# EAGLE schematic Electronics_Design_v1 v27 (EAGLE 9.7.0)
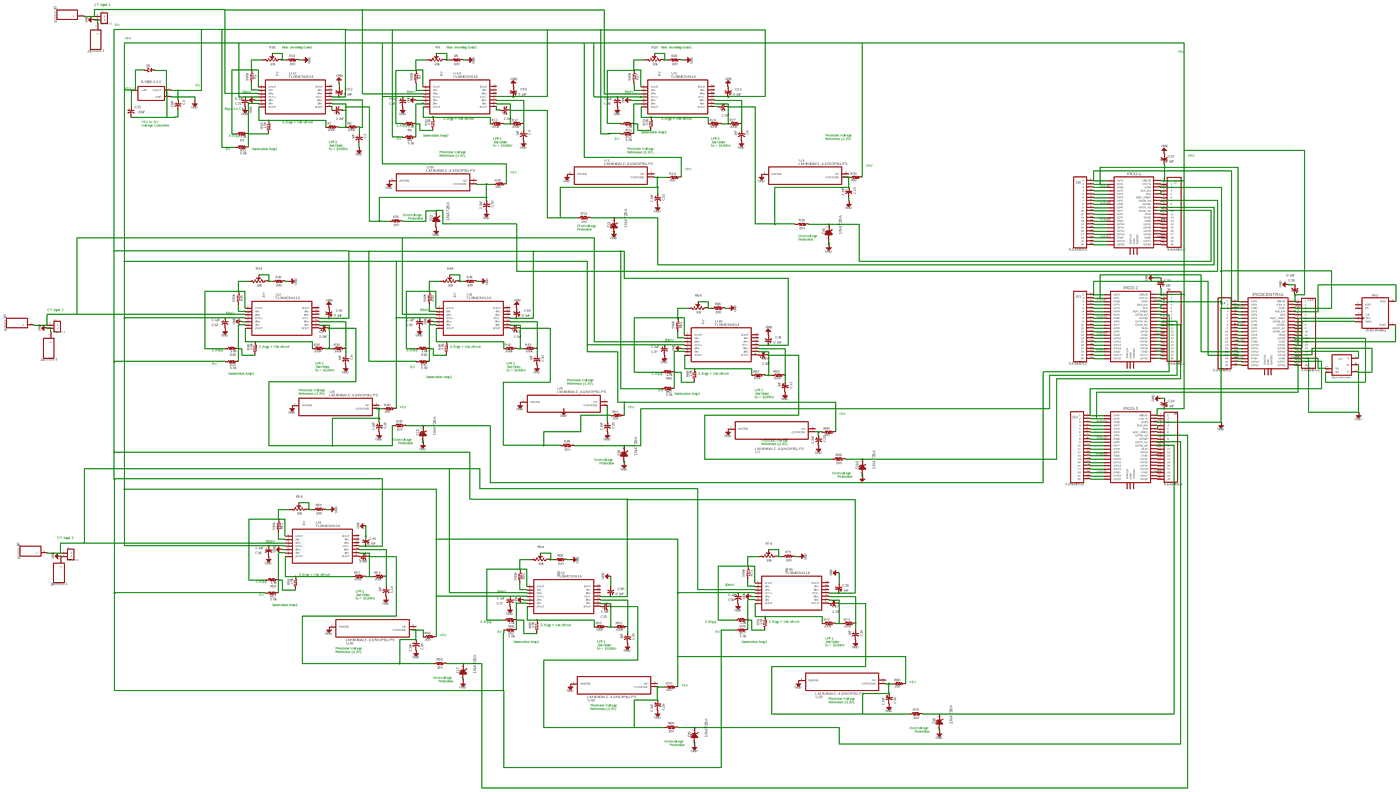
[diagram p0: schematic, sheet 1, overview]
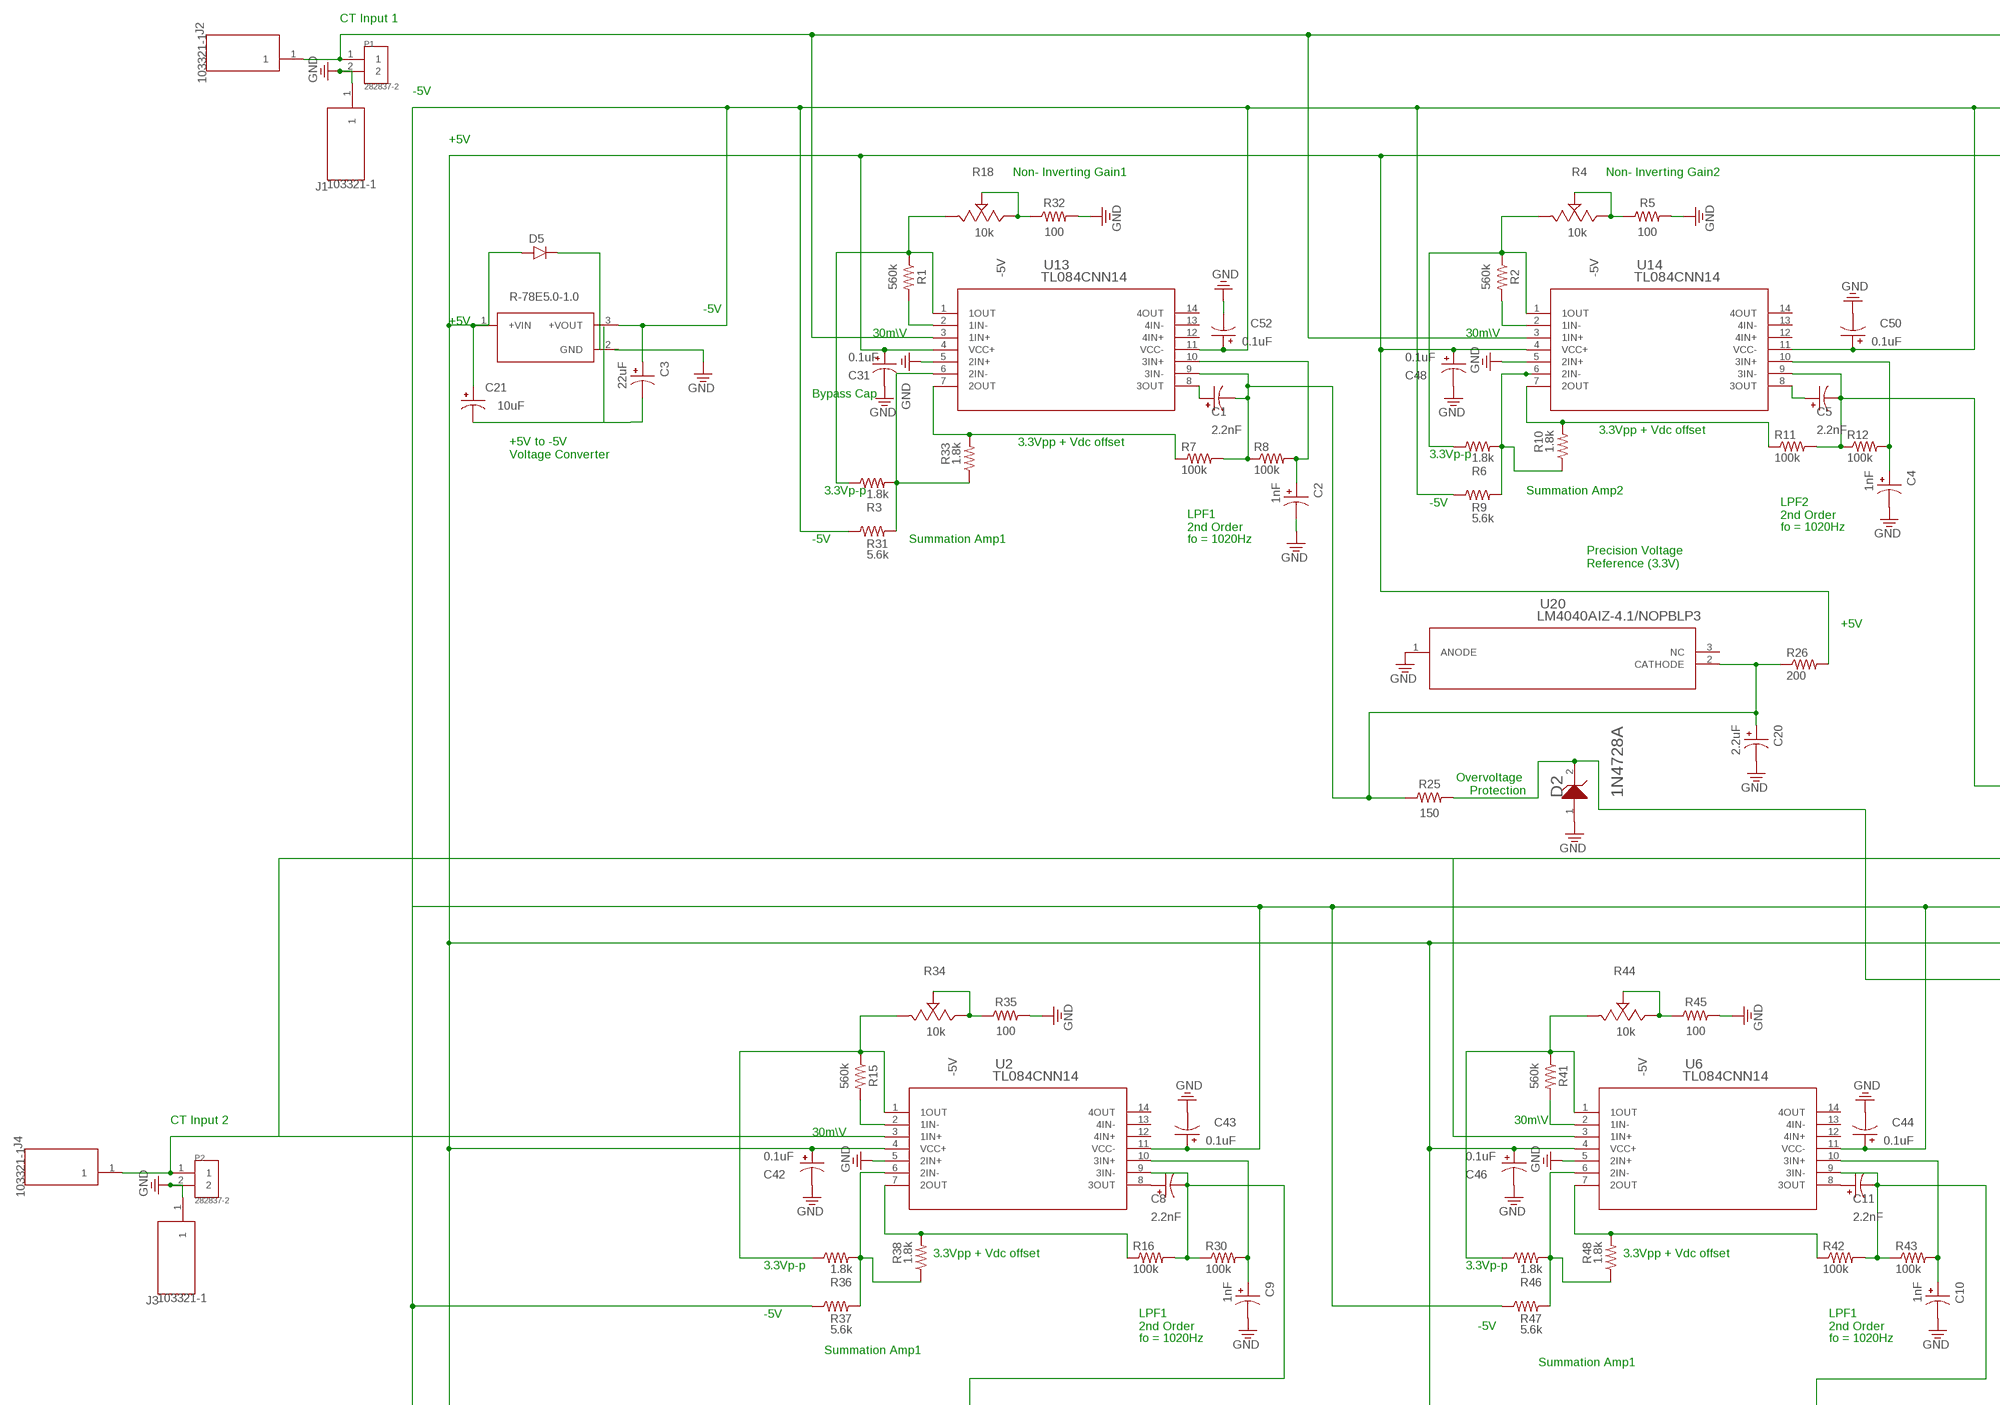
[diagram p1: schematic, sheet 1, part 1 of 6]
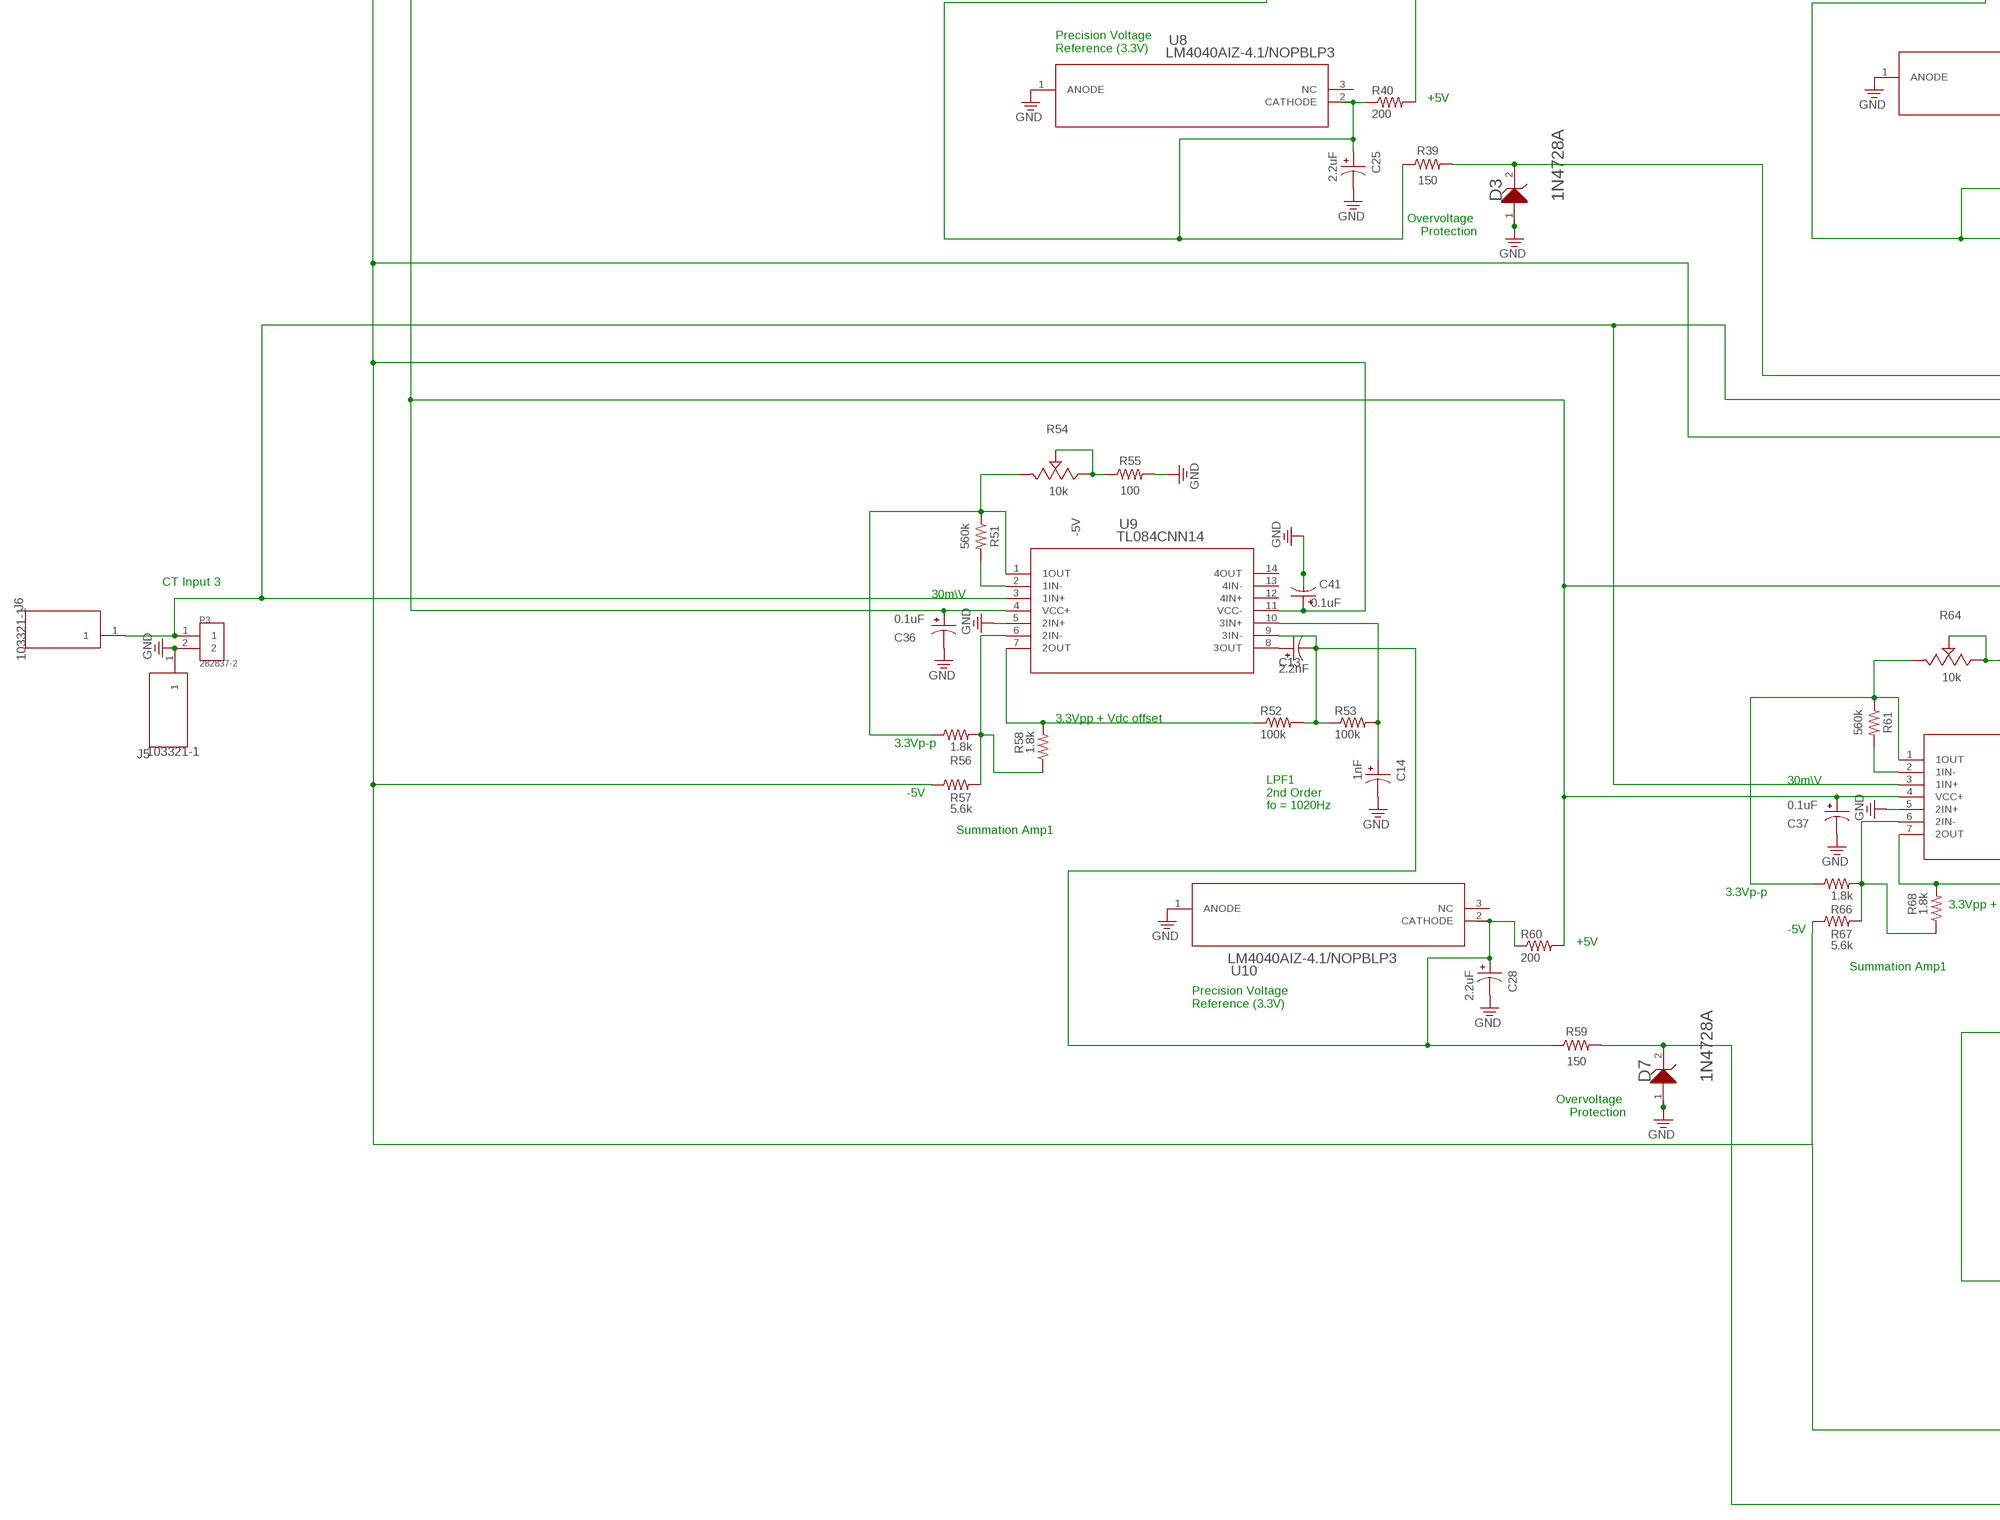
[diagram p2: schematic, sheet 1, part 2 of 6]
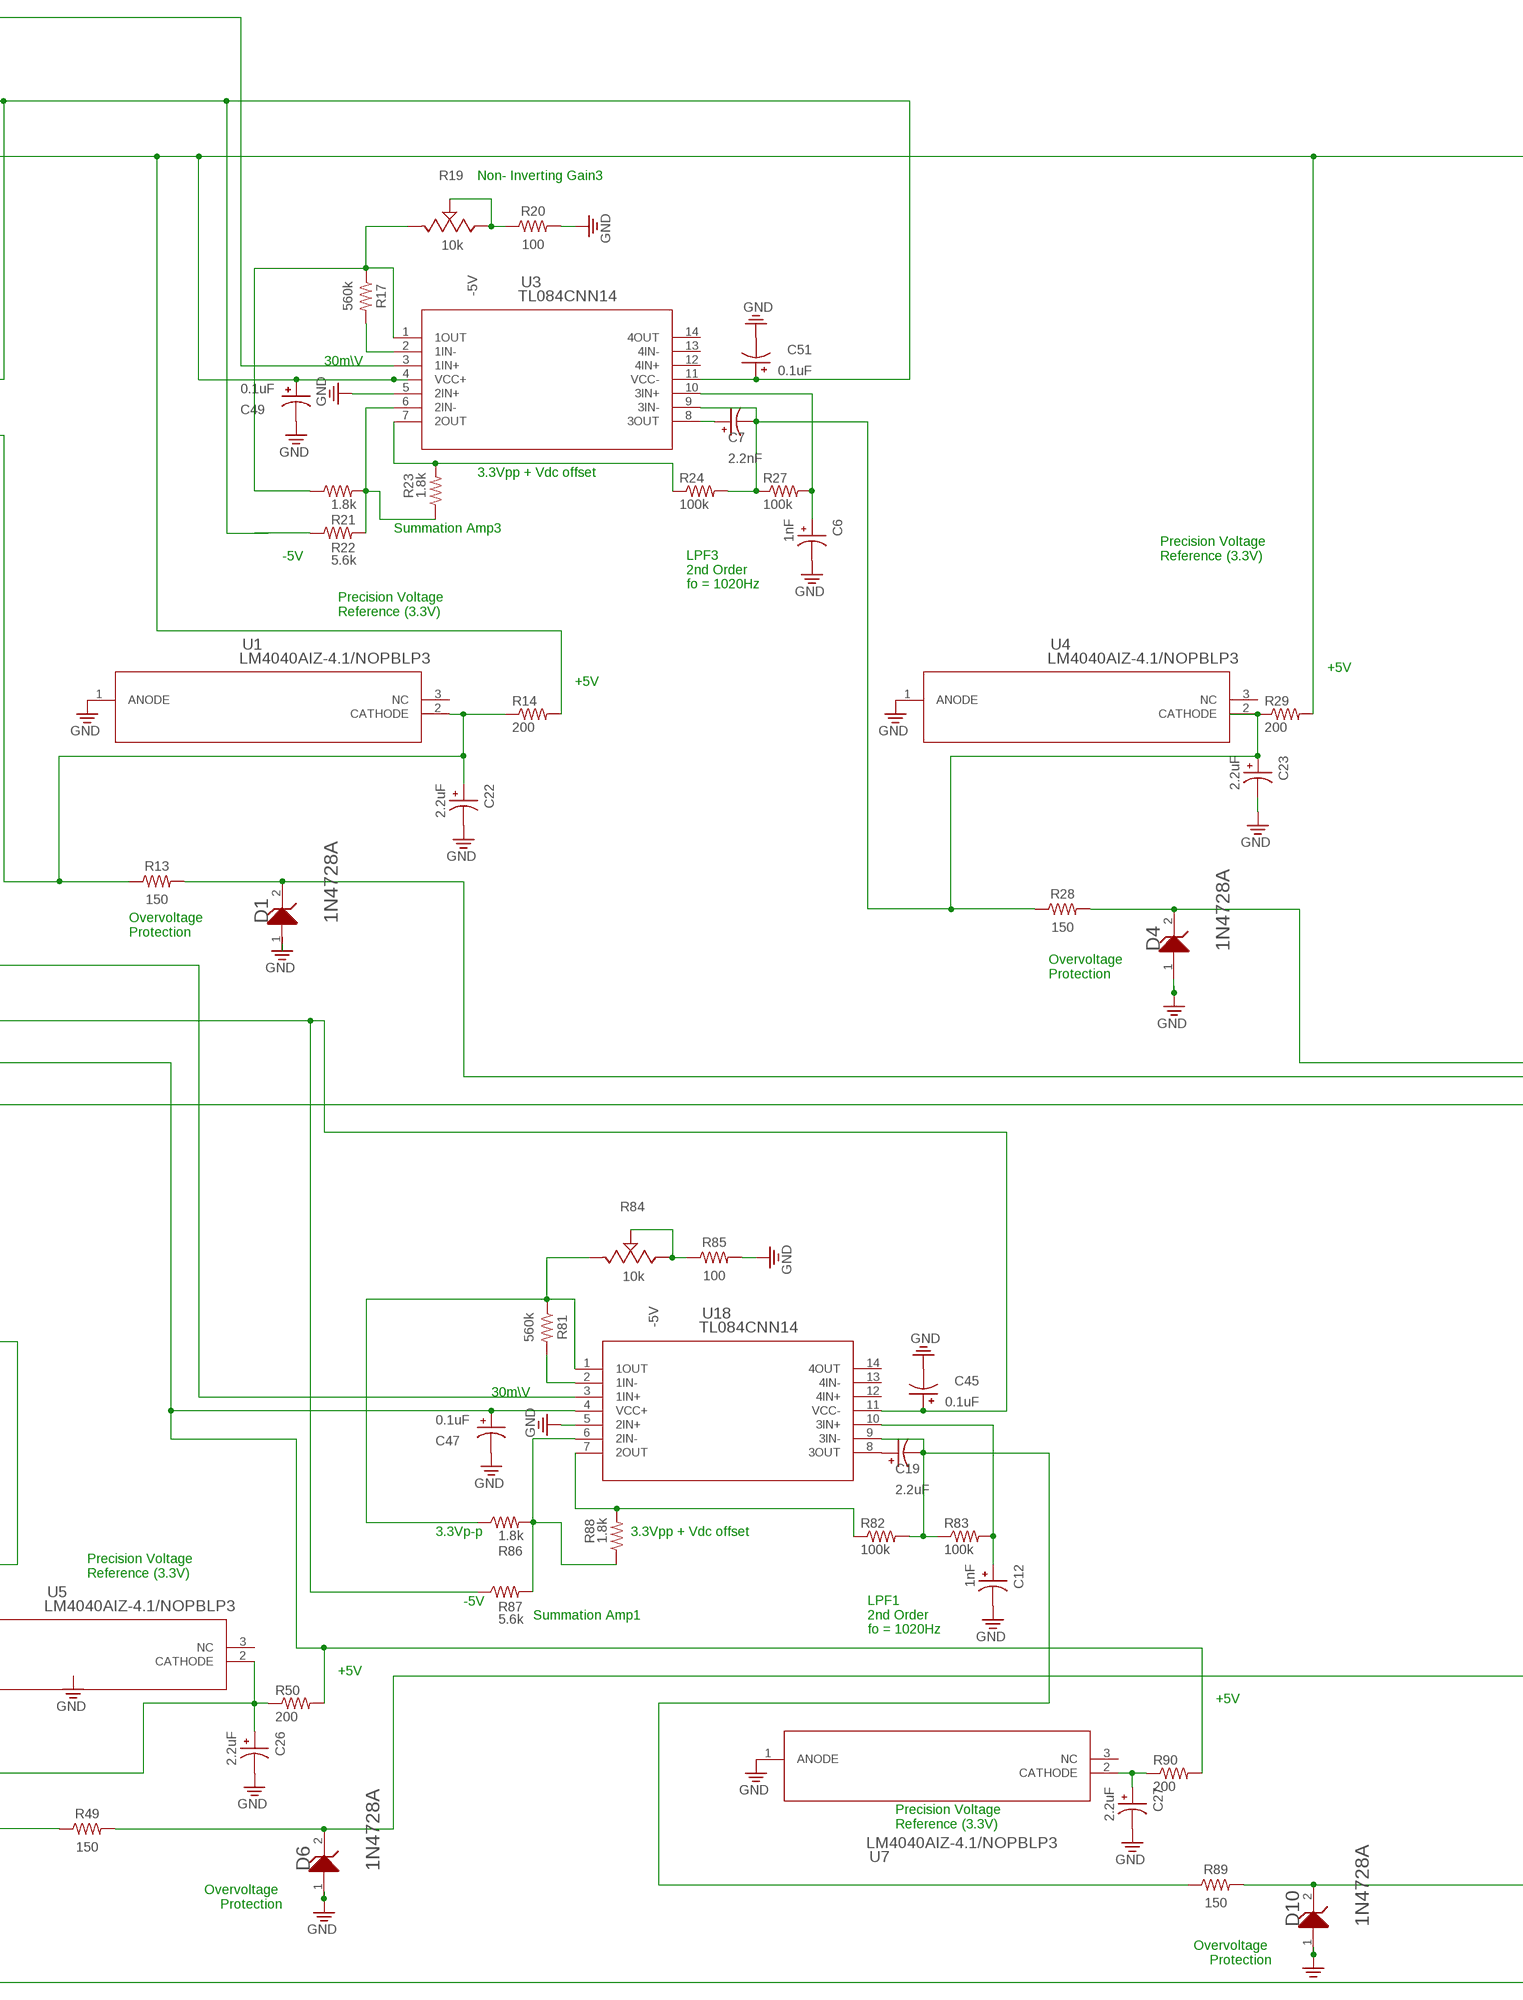
[diagram p3: schematic, sheet 1, part 3 of 6]
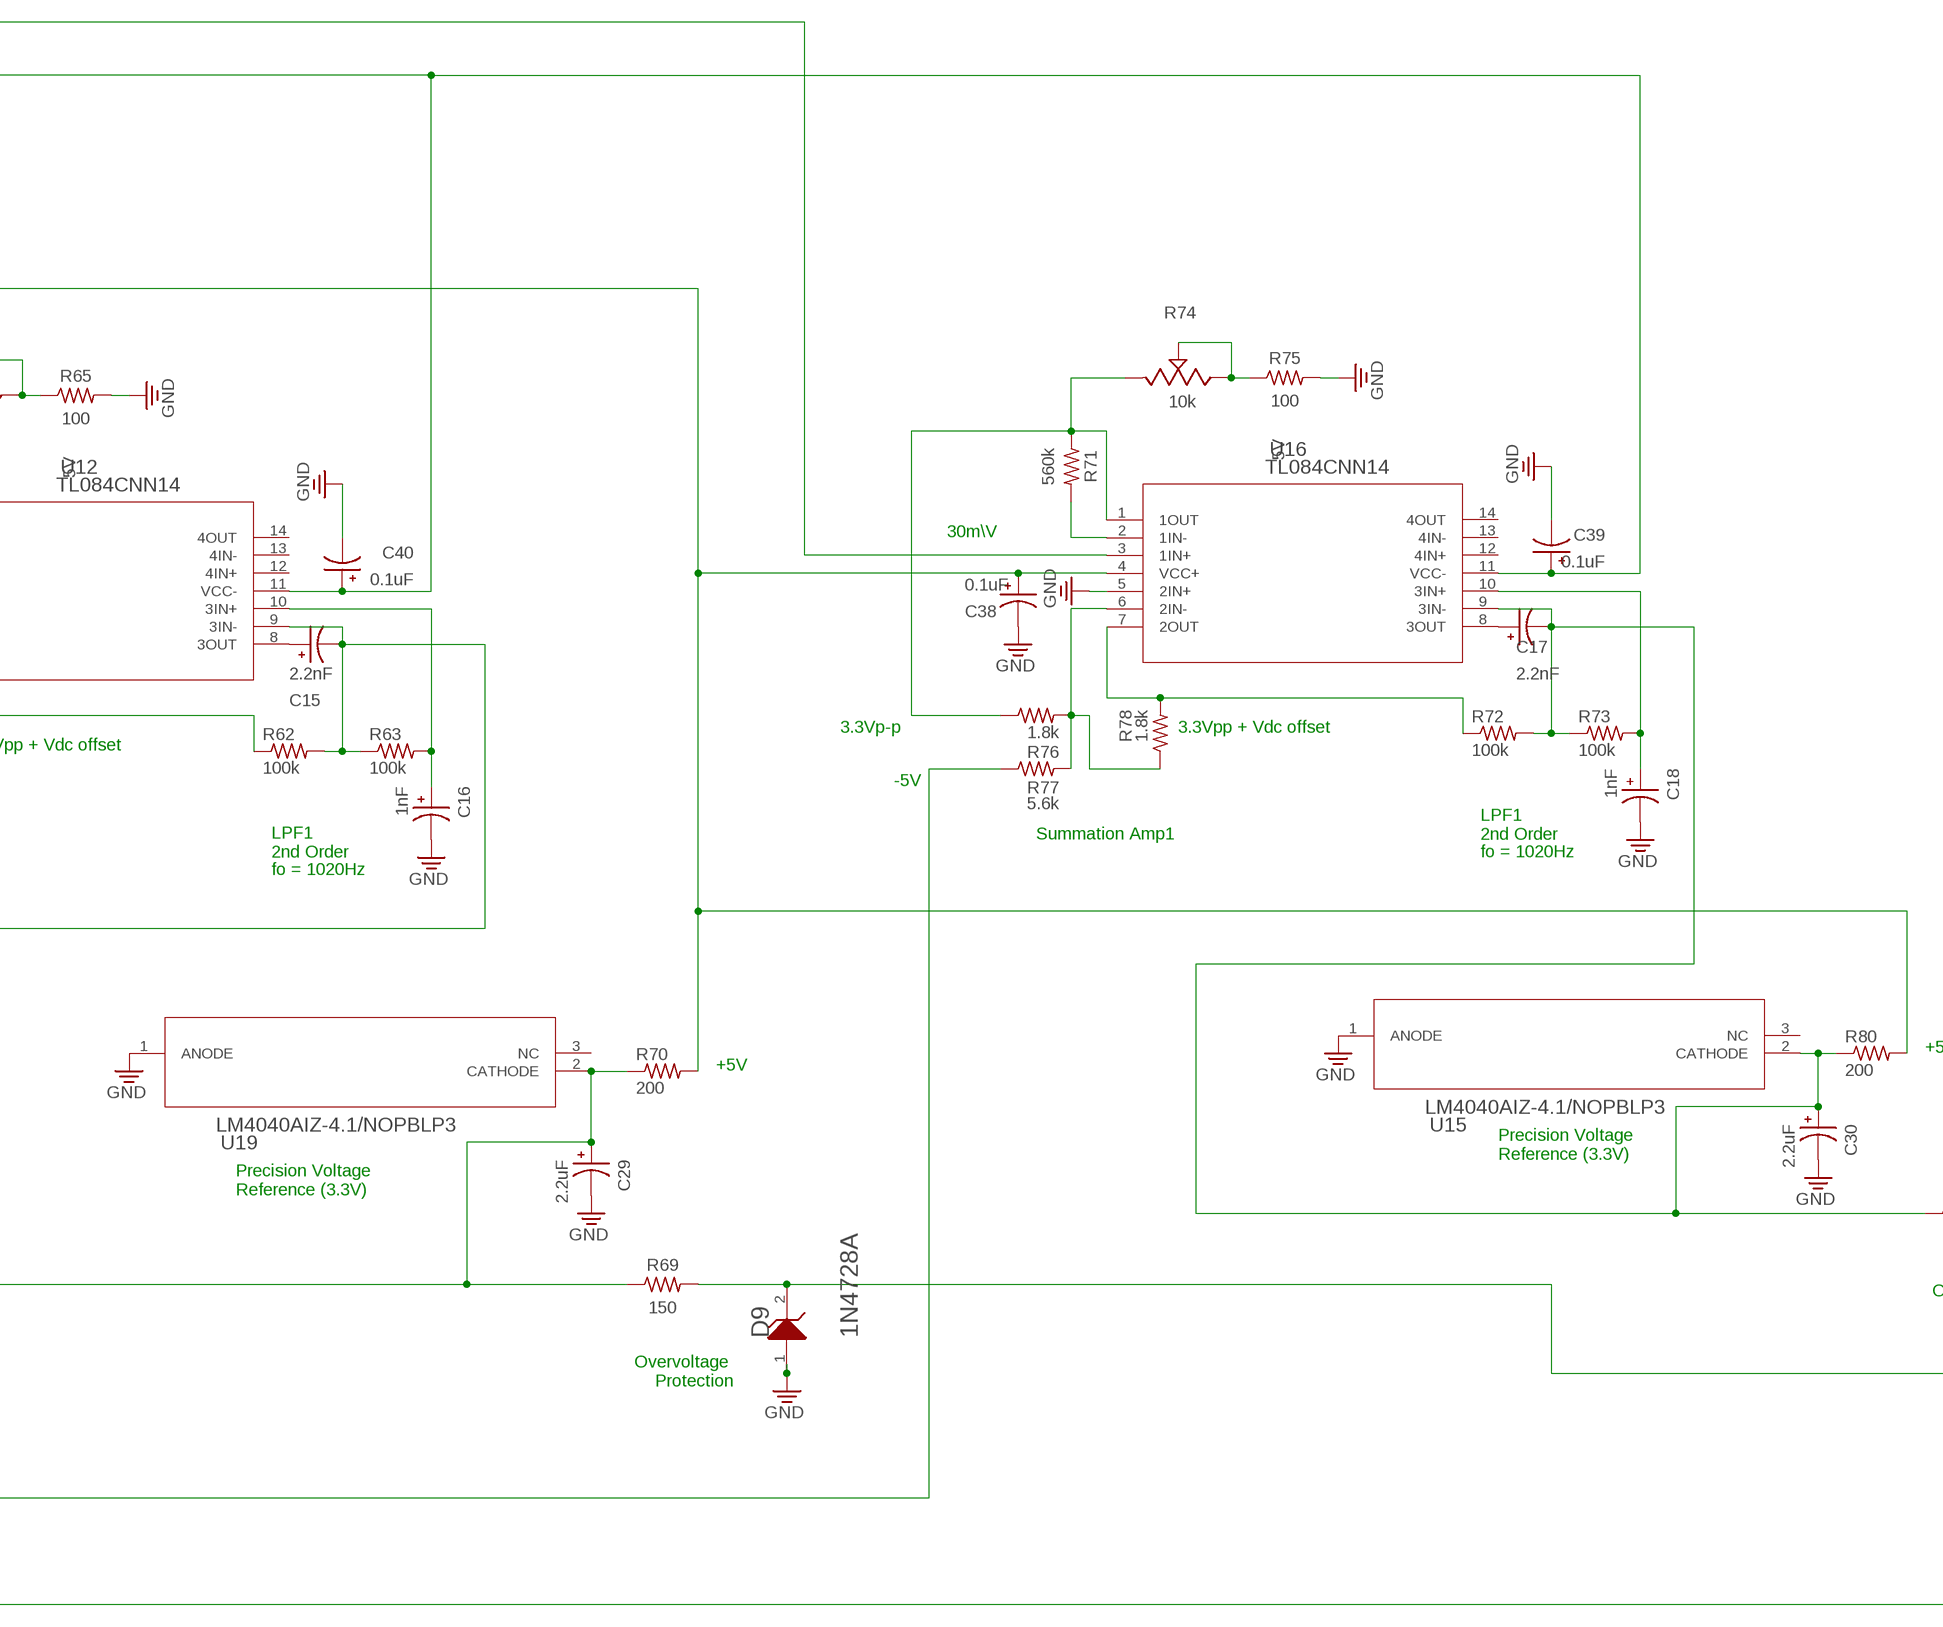
[diagram p4: schematic, sheet 1, part 4 of 6]
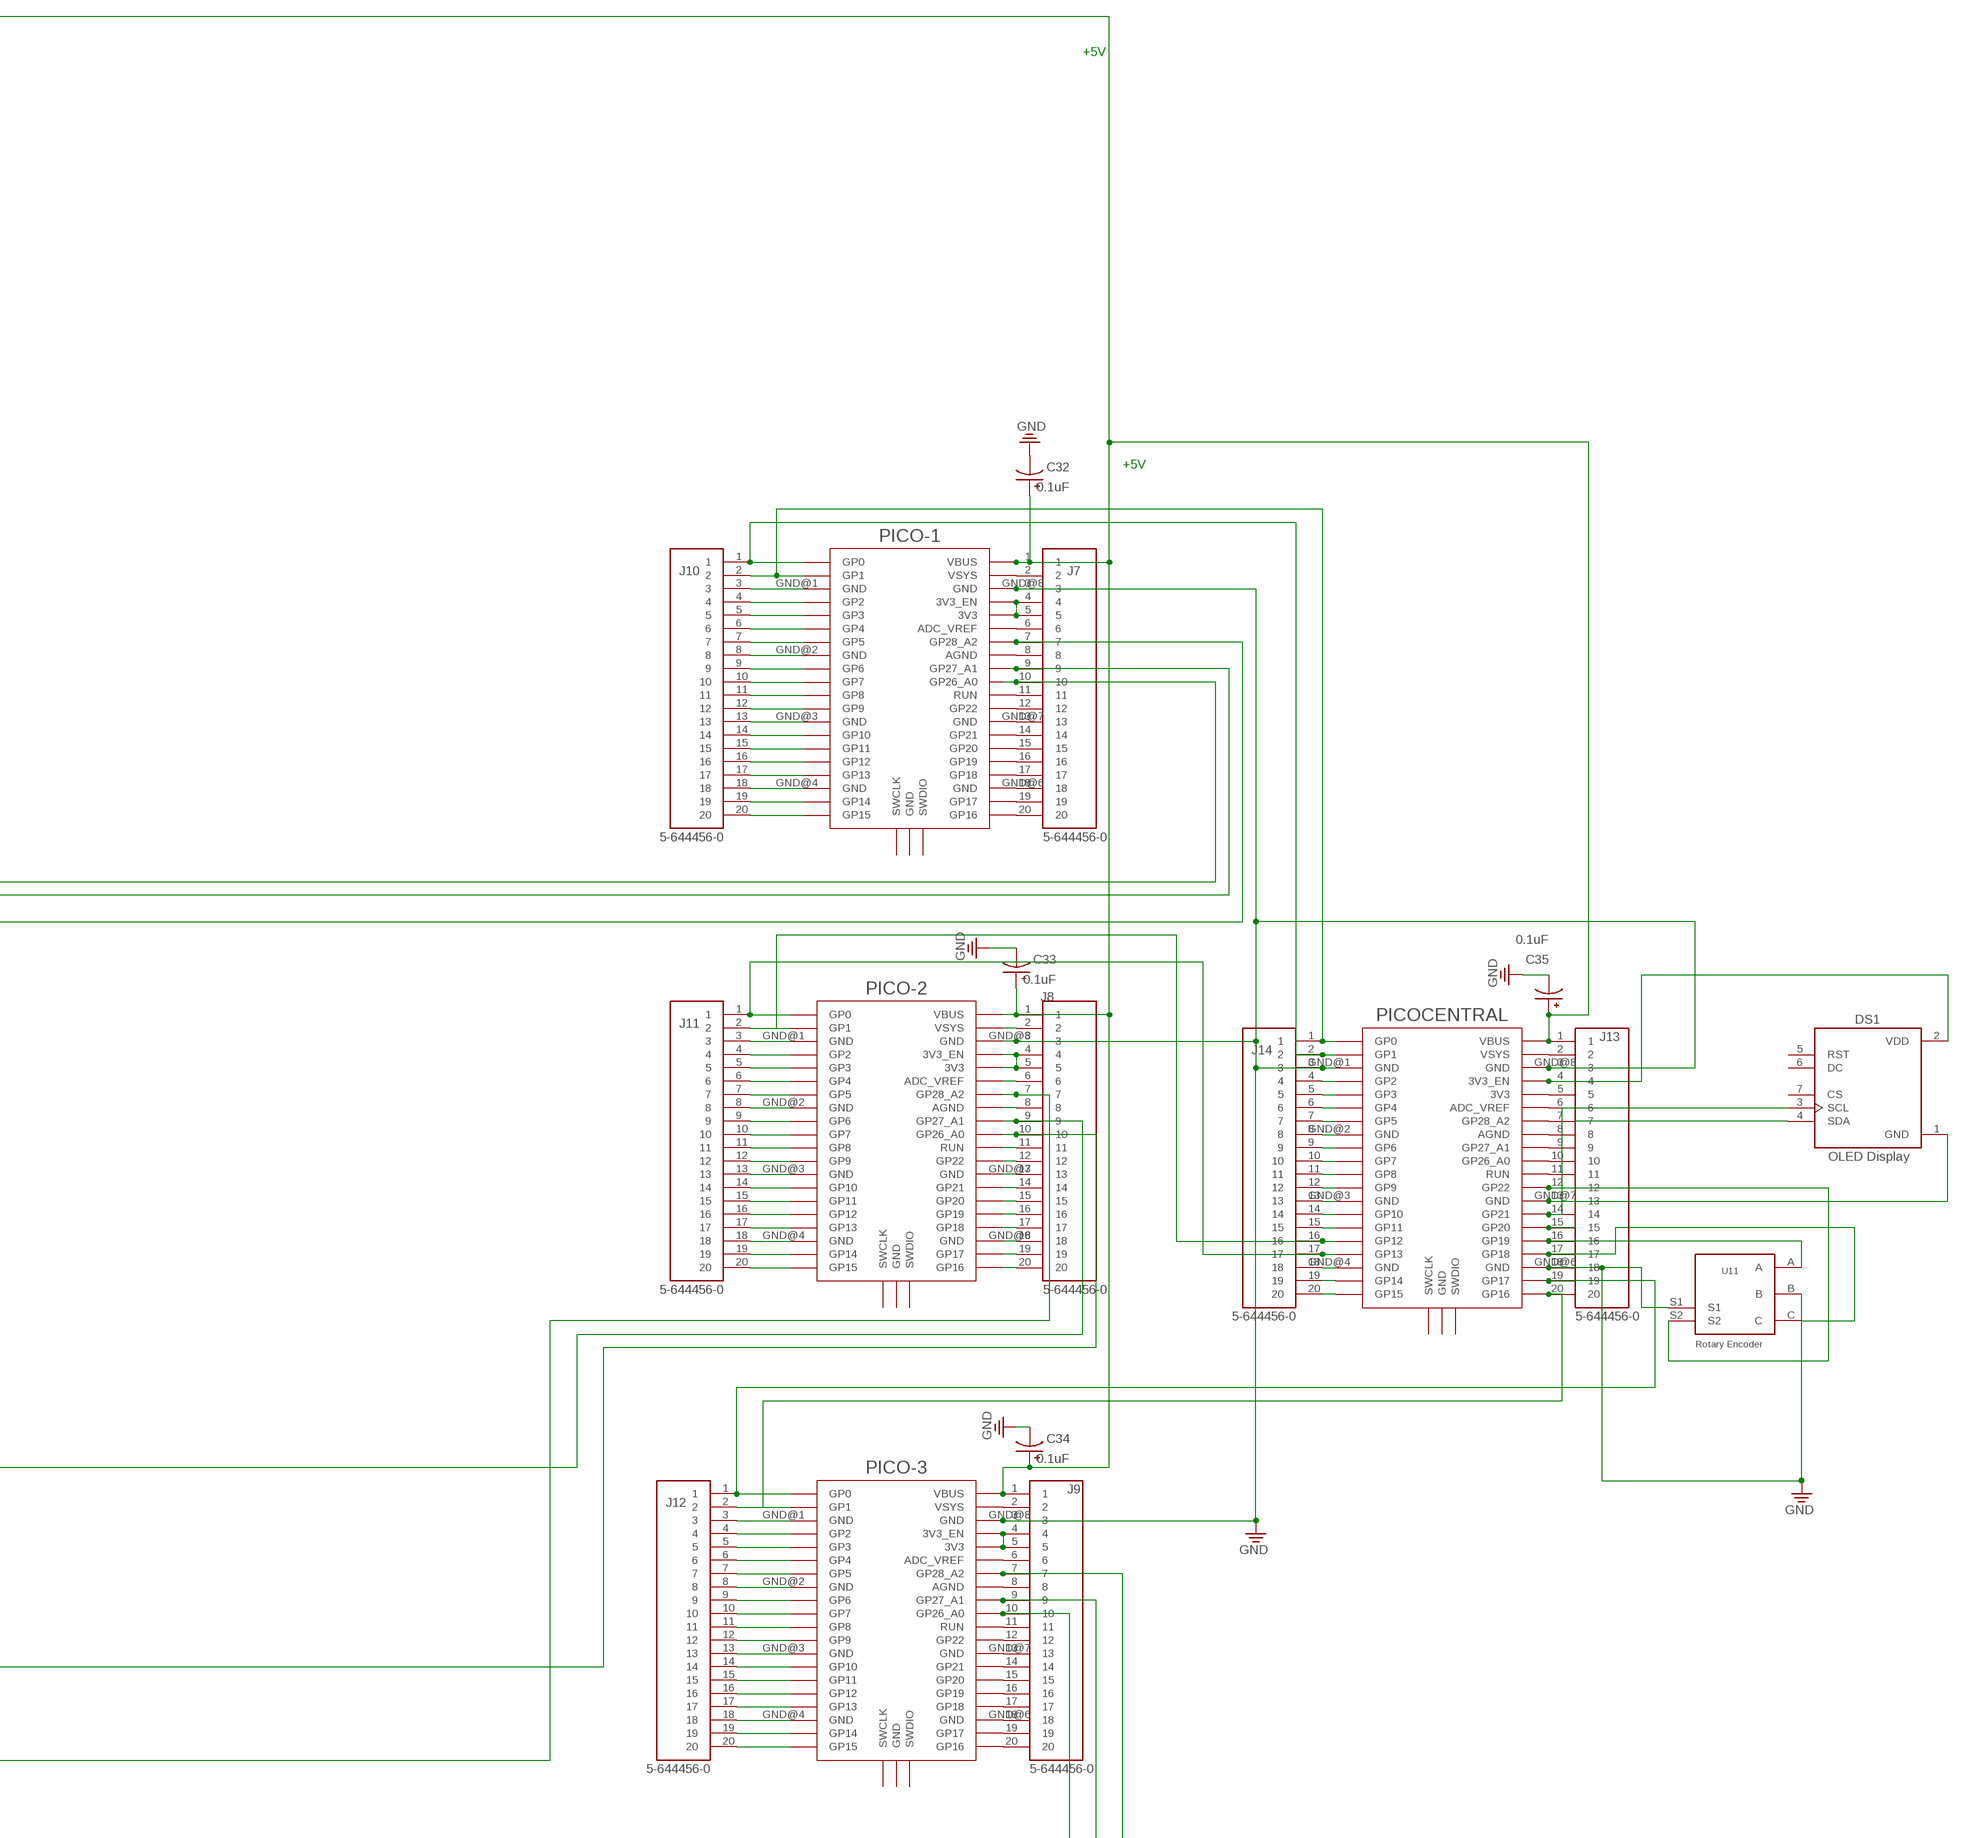
[diagram p5: schematic, sheet 1, part 5 of 6]
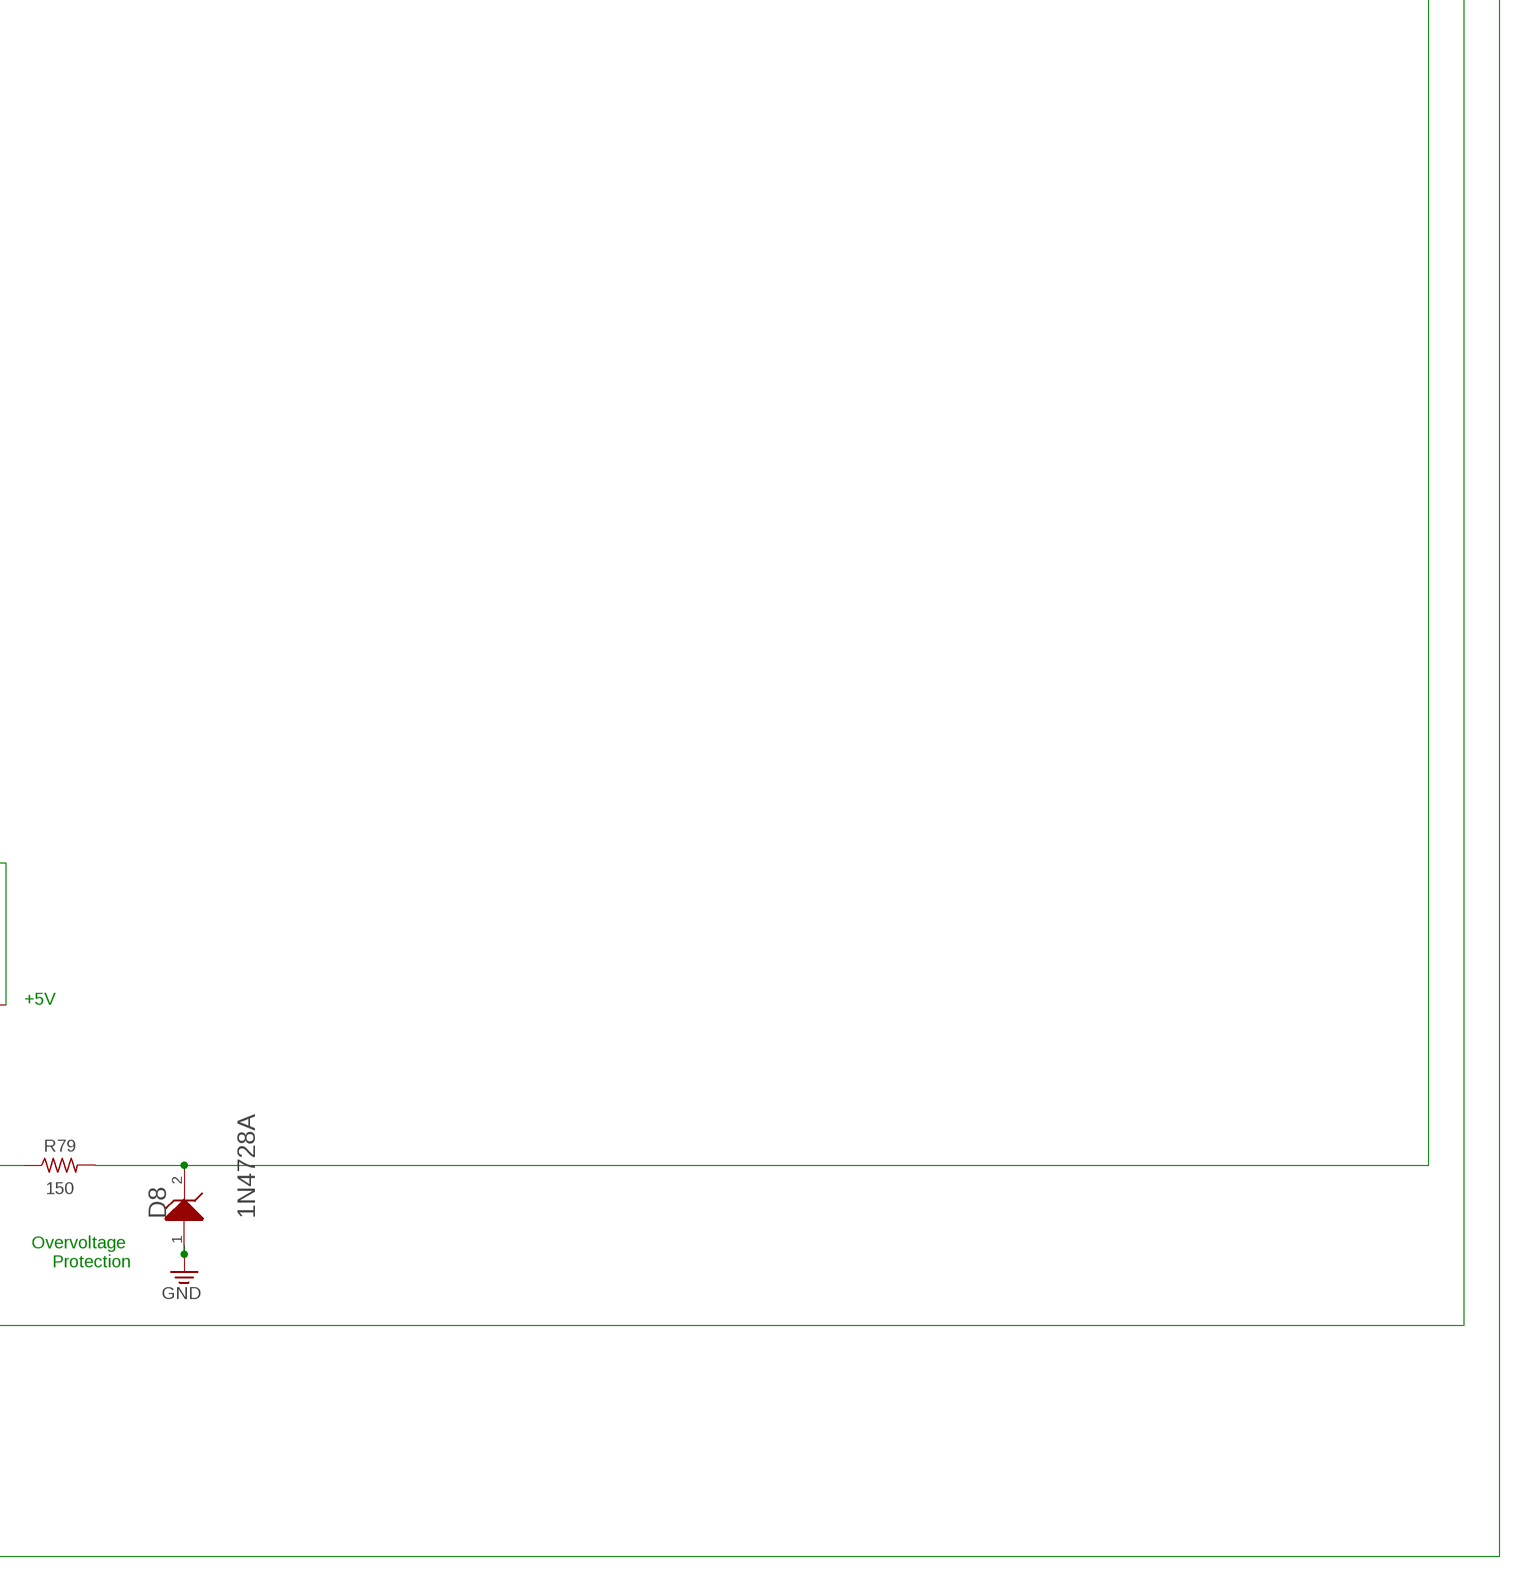
[diagram p6: schematic, sheet 1, part 6 of 6]

## Parts
C1  2.2nF  UPM2A100MED  [CAPPRD250W50D630H1250]
C2  1nF  UPM2A100MED  [CAPPRD250W50D630H1250]
C3  22uF  UPM2A100MED  [CAPPRD250W50D630H1250]
C4  1nF  UPM2A100MED  [CAPPRD250W50D630H1250]
C5  2.2nF  UPM2A100MED  [CAPPRD250W50D630H1250]
C6  1nF  UPM2A100MED  [CAPPRD250W50D630H1250]
C7  2.2nF  UPM2A100MED  [CAPPRD250W50D630H1250]
C8  2.2nF  UPM2A100MED  [CAPPRD250W50D630H1250]
C9  1nF  UPM2A100MED  [CAPPRD250W50D630H1250]
C10  1nF  UPM2A100MED  [CAPPRD250W50D630H1250]
C11  2.2nF  UPM2A100MED  [CAPPRD250W50D630H1250]
C12  1nF  UPM2A100MED  [CAPPRD250W50D630H1250]
C13  2.2nF  UPM2A100MED  [CAPPRD250W50D630H1250]
C14  1nF  UPM2A100MED  [CAPPRD250W50D630H1250]
C15  2.2nF  UPM2A100MED  [CAPPRD250W50D630H1250]
C16  1nF  UPM2A100MED  [CAPPRD250W50D630H1250]
C17  2.2nF  UPM2A100MED  [CAPPRD250W50D630H1250]
C18  1nF  UPM2A100MED  [CAPPRD250W50D630H1250]
C19  2.2uF  UPM2A100MED  [CAPPRD250W50D630H1250]
C20  2.2uF  UPM2A100MED  [CAPPRD250W50D630H1250]
C21  10uF  UPM2A100MED  [CAPPRD250W50D630H1250]
C22  2.2uF  UPM2A100MED  [CAPPRD250W50D630H1250]
C23  2.2uF  UPM2A100MED  [CAPPRD250W50D630H1250]
C25  2.2uF  UPM2A100MED  [CAPPRD250W50D630H1250]
C26  2.2uF  UPM2A100MED  [CAPPRD250W50D630H1250]
C27  2.2uF  UPM2A100MED  [CAPPRD250W50D630H1250]
C28  2.2uF  UPM2A100MED  [CAPPRD250W50D630H1250]
C29  2.2uF  UPM2A100MED  [CAPPRD250W50D630H1250]
C30  2.2uF  UPM2A100MED  [CAPPRD250W50D630H1250]
C31  0.1uF  UPM2A100MED  [CAPPRD250W50D630H1250]
C32  0.1uF  UPM2A100MED  [CAPPRD250W50D630H1250]
C33  0.1uF  UPM2A100MED  [CAPPRD250W50D630H1250]
C34  0.1uF  UPM2A100MED  [CAPPRD250W50D630H1250]
C35  0.1uF  UPM2A100MED  [CAPPRD250W50D630H1250]
C36  0.1uF  UPM2A100MED  [CAPPRD250W50D630H1250]
C37  0.1uF  UPM2A100MED  [CAPPRD250W50D630H1250]
C38  0.1uF  UPM2A100MED  [CAPPRD250W50D630H1250]
C39  0.1uF  UPM2A100MED  [CAPPRD250W50D630H1250]
C40  0.1uF  UPM2A100MED  [CAPPRD250W50D630H1250]
C41  0.1uF  UPM2A100MED  [CAPPRD250W50D630H1250]
C42  0.1uF  UPM2A100MED  [CAPPRD250W50D630H1250]
C43  0.1uF  UPM2A100MED  [CAPPRD250W50D630H1250]
C44  0.1uF  UPM2A100MED  [CAPPRD250W50D630H1250]
C45  0.1uF  UPM2A100MED  [CAPPRD250W50D630H1250]
C46  0.1uF  UPM2A100MED  [CAPPRD250W50D630H1250]
C47  0.1uF  UPM2A100MED  [CAPPRD250W50D630H1250]
C48  0.1uF  UPM2A100MED  [CAPPRD250W50D630H1250]
C49  0.1uF  UPM2A100MED  [CAPPRD250W50D630H1250]
C50  0.1uF  UPM2A100MED  [CAPPRD250W50D630H1250]
C51  0.1uF  UPM2A100MED  [CAPPRD250W50D630H1250]
C52  0.1uF  UPM2A100MED  [CAPPRD250W50D630H1250]
D1  FAIRCHILD_SEMICONDUCTOR_1N4728AFAIRCHILD_SEMICONDUCTOR_1N4728A_0_0  [FAIRCHILD_SEMICONDUCTOR_1N4728A_0]
D2  FAIRCHILD_SEMICONDUCTOR_1N4728AFAIRCHILD_SEMICONDUCTOR_1N4728A_0_0  [FAIRCHILD_SEMICONDUCTOR_1N4728A_0]
D3  FAIRCHILD_SEMICONDUCTOR_1N4728AFAIRCHILD_SEMICONDUCTOR_1N4728A_0_0  [FAIRCHILD_SEMICONDUCTOR_1N4728A_0]
D4  FAIRCHILD_SEMICONDUCTOR_1N4728AFAIRCHILD_SEMICONDUCTOR_1N4728A_0_0  [FAIRCHILD_SEMICONDUCTOR_1N4728A_0]
D5  1N914.4  [DO35-4]
D6  FAIRCHILD_SEMICONDUCTOR_1N4728AFAIRCHILD_SEMICONDUCTOR_1N4728A_0_0  [FAIRCHILD_SEMICONDUCTOR_1N4728A_0]
D7  FAIRCHILD_SEMICONDUCTOR_1N4728AFAIRCHILD_SEMICONDUCTOR_1N4728A_0_0  [FAIRCHILD_SEMICONDUCTOR_1N4728A_0]
D8  FAIRCHILD_SEMICONDUCTOR_1N4728AFAIRCHILD_SEMICONDUCTOR_1N4728A_0_0  [FAIRCHILD_SEMICONDUCTOR_1N4728A_0]
D9  FAIRCHILD_SEMICONDUCTOR_1N4728AFAIRCHILD_SEMICONDUCTOR_1N4728A_0_0  [FAIRCHILD_SEMICONDUCTOR_1N4728A_0]
D10  FAIRCHILD_SEMICONDUCTOR_1N4728AFAIRCHILD_SEMICONDUCTOR_1N4728A_0_0  [FAIRCHILD_SEMICONDUCTOR_1N4728A_0]
DS1  OLED Display  AOM12864A0-1.54WW-ANO  [LCD_AOM12864A0-1.54WW-ANO]
J1  103321-1  [TE_103321-1]
J2  103321-1  [TE_103321-1]
J3  103321-1  [TE_103321-1]
J4  103321-1  [TE_103321-1]
J5  103321-1  [TE_103321-1]
J6  103321-1  [TE_103321-1]
J7  5-644456-0  [TE_5-644456-0]
J8  5-644456-0  [TE_5-644456-0]
J9  5-644456-0  [TE_5-644456-0]
J10  5-644456-0  [TE_5-644456-0]
J11  5-644456-0  [TE_5-644456-0]
J12  5-644456-0  [TE_5-644456-0]
J13  5-644456-0  [TE_5-644456-0]
J14  5-644456-0  [TE_5-644456-0]
P1  282837-2  [TE_282837-2]
P2  282837-2  [TE_282837-2]
P3  282837-2  [TE_282837-2]
PICO-1  Piico Pi  RPI_PICO_IG-TH  [RPI_PICO_TH]
PICO-2  RPI_PICO_IG-TH  [RPI_PICO_TH]
PICO-3  RPI_PICO_IG-TH  [RPI_PICO_TH]
PICOCENTRAL  RPI_PICO_IG-TH  [RPI_PICO_TH]
PS1  R-78E5.0-1.0  [CONV_R-78E5.0-1.0]
R1  560k  R-US_AXIAL-7.2MM-PITCH  [RESAD724W46L381D178B]
R2  560k  R-US_AXIAL-7.2MM-PITCH  [RESAD724W46L381D178B]
R3  1.8k  R-US_AXIAL-7.2MM-PITCH  [RESAD724W46L381D178B]
R4  10k  3362P-1-103LF  [3362P-1-103LF]
R5  100  R-US_AXIAL-7.2MM-PITCH  [RESAD724W46L381D178B]
R6  1.8k  R-US_AXIAL-7.2MM-PITCH  [RESAD724W46L381D178B]
R7  100k  R-US_AXIAL-7.2MM-PITCH  [RESAD724W46L381D178B]
R8  100k  R-US_AXIAL-7.2MM-PITCH  [RESAD724W46L381D178B]
R9  5.6k  R-US_AXIAL-7.2MM-PITCH  [RESAD724W46L381D178B]
R10  1.8k  R-US_AXIAL-7.2MM-PITCH  [RESAD724W46L381D178B]
R11  100k  R-US_AXIAL-7.2MM-PITCH  [RESAD724W46L381D178B]
R12  100k  R-US_AXIAL-7.2MM-PITCH  [RESAD724W46L381D178B]
R13  150  R-US_AXIAL-7.2MM-PITCH  [RESAD724W46L381D178B]
R14  200  R-US_AXIAL-7.2MM-PITCH  [RESAD724W46L381D178B]
R15  560k  R-US_AXIAL-7.2MM-PITCH  [RESAD724W46L381D178B]
R16  100k  R-US_AXIAL-7.2MM-PITCH  [RESAD724W46L381D178B]
R17  560k  R-US_AXIAL-7.2MM-PITCH  [RESAD724W46L381D178B]
R18  10k  3362P-1-103LF  [3362P-1-103LF]
R19  10k  3362P-1-103LF  [3362P-1-103LF]
R20  100  R-US_AXIAL-7.2MM-PITCH  [RESAD724W46L381D178B]
R21  1.8k  R-US_AXIAL-7.2MM-PITCH  [RESAD724W46L381D178B]
R22  5.6k  R-US_AXIAL-7.2MM-PITCH  [RESAD724W46L381D178B]
R23  1.8k  R-US_AXIAL-7.2MM-PITCH  [RESAD724W46L381D178B]
R24  100k  R-US_AXIAL-7.2MM-PITCH  [RESAD724W46L381D178B]
R25  150  R-US_AXIAL-7.2MM-PITCH  [RESAD724W46L381D178B]
R26  200  R-US_AXIAL-7.2MM-PITCH  [RESAD724W46L381D178B]
R27  100k  R-US_AXIAL-7.2MM-PITCH  [RESAD724W46L381D178B]
R28  150  R-US_AXIAL-7.2MM-PITCH  [RESAD724W46L381D178B]
R29  200  R-US_AXIAL-7.2MM-PITCH  [RESAD724W46L381D178B]
R30  100k  R-US_AXIAL-7.2MM-PITCH  [RESAD724W46L381D178B]
R31  5.6k  R-US_AXIAL-7.2MM-PITCH  [RESAD724W46L381D178B]
R32  100  R-US_AXIAL-7.2MM-PITCH  [RESAD724W46L381D178B]
R33  1.8k  R-US_AXIAL-7.2MM-PITCH  [RESAD724W46L381D178B]
R34  10k  3362P-1-103LF  [3362P-1-103LF]
R35  100  R-US_AXIAL-7.2MM-PITCH  [RESAD724W46L381D178B]
R36  1.8k  R-US_AXIAL-7.2MM-PITCH  [RESAD724W46L381D178B]
R37  5.6k  R-US_AXIAL-7.2MM-PITCH  [RESAD724W46L381D178B]
R38  1.8k  R-US_AXIAL-7.2MM-PITCH  [RESAD724W46L381D178B]
R39  150  R-US_AXIAL-7.2MM-PITCH  [RESAD724W46L381D178B]
R40  200  R-US_AXIAL-7.2MM-PITCH  [RESAD724W46L381D178B]
R41  560k  R-US_AXIAL-7.2MM-PITCH  [RESAD724W46L381D178B]
R42  100k  R-US_AXIAL-7.2MM-PITCH  [RESAD724W46L381D178B]
R43  100k  R-US_AXIAL-7.2MM-PITCH  [RESAD724W46L381D178B]
R44  10k  3362P-1-103LF  [3362P-1-103LF]
R45  100  R-US_AXIAL-7.2MM-PITCH  [RESAD724W46L381D178B]
R46  1.8k  R-US_AXIAL-7.2MM-PITCH  [RESAD724W46L381D178B]
R47  5.6k  R-US_AXIAL-7.2MM-PITCH  [RESAD724W46L381D178B]
R48  1.8k  R-US_AXIAL-7.2MM-PITCH  [RESAD724W46L381D178B]
R49  150  R-US_AXIAL-7.2MM-PITCH  [RESAD724W46L381D178B]
R50  200  R-US_AXIAL-7.2MM-PITCH  [RESAD724W46L381D178B]
R51  560k  R-US_AXIAL-7.2MM-PITCH  [RESAD724W46L381D178B]
R52  100k  R-US_AXIAL-7.2MM-PITCH  [RESAD724W46L381D178B]
R53  100k  R-US_AXIAL-7.2MM-PITCH  [RESAD724W46L381D178B]
R54  10k  3362P-1-103LF  [3362P-1-103LF]
R55  100  R-US_AXIAL-7.2MM-PITCH  [RESAD724W46L381D178B]
R56  1.8k  R-US_AXIAL-7.2MM-PITCH  [RESAD724W46L381D178B]
R57  5.6k  R-US_AXIAL-7.2MM-PITCH  [RESAD724W46L381D178B]
R58  1.8k  R-US_AXIAL-7.2MM-PITCH  [RESAD724W46L381D178B]
R59  150  R-US_AXIAL-7.2MM-PITCH  [RESAD724W46L381D178B]
R60  200  R-US_AXIAL-7.2MM-PITCH  [RESAD724W46L381D178B]
R61  560k  R-US_AXIAL-7.2MM-PITCH  [RESAD724W46L381D178B]
R62  100k  R-US_AXIAL-7.2MM-PITCH  [RESAD724W46L381D178B]
R63  100k  R-US_AXIAL-7.2MM-PITCH  [RESAD724W46L381D178B]
R64  10k  3362P-1-103LF  [3362P-1-103LF]
R65  100  R-US_AXIAL-7.2MM-PITCH  [RESAD724W46L381D178B]
R66  1.8k  R-US_AXIAL-7.2MM-PITCH  [RESAD724W46L381D178B]
R67  5.6k  R-US_AXIAL-7.2MM-PITCH  [RESAD724W46L381D178B]
R68  1.8k  R-US_AXIAL-7.2MM-PITCH  [RESAD724W46L381D178B]
R69  150  R-US_AXIAL-7.2MM-PITCH  [RESAD724W46L381D178B]
R70  200  R-US_AXIAL-7.2MM-PITCH  [RESAD724W46L381D178B]
R71  560k  R-US_AXIAL-7.2MM-PITCH  [RESAD724W46L381D178B]
R72  100k  R-US_AXIAL-7.2MM-PITCH  [RESAD724W46L381D178B]
R73  100k  R-US_AXIAL-7.2MM-PITCH  [RESAD724W46L381D178B]
R74  10k  3362P-1-103LF  [3362P-1-103LF]
R75  100  R-US_AXIAL-7.2MM-PITCH  [RESAD724W46L381D178B]
R76  1.8k  R-US_AXIAL-7.2MM-PITCH  [RESAD724W46L381D178B]
R77  5.6k  R-US_AXIAL-7.2MM-PITCH  [RESAD724W46L381D178B]
R78  1.8k  R-US_AXIAL-7.2MM-PITCH  [RESAD724W46L381D178B]
R79  150  R-US_AXIAL-7.2MM-PITCH  [RESAD724W46L381D178B]
R80  200  R-US_AXIAL-7.2MM-PITCH  [RESAD724W46L381D178B]
R81  560k  R-US_AXIAL-7.2MM-PITCH  [RESAD724W46L381D178B]
R82  100k  R-US_AXIAL-7.2MM-PITCH  [RESAD724W46L381D178B]
R83  100k  R-US_AXIAL-7.2MM-PITCH  [RESAD724W46L381D178B]
R84  10k  3362P-1-103LF  [3362P-1-103LF]
R85  100  R-US_AXIAL-7.2MM-PITCH  [RESAD724W46L381D178B]
R86  1.8k  R-US_AXIAL-7.2MM-PITCH  [RESAD724W46L381D178B]
R87  5.6k  R-US_AXIAL-7.2MM-PITCH  [RESAD724W46L381D178B]
R88  1.8k  R-US_AXIAL-7.2MM-PITCH  [RESAD724W46L381D178B]
R89  150  R-US_AXIAL-7.2MM-PITCH  [RESAD724W46L381D178B]
R90  200  R-US_AXIAL-7.2MM-PITCH  [RESAD724W46L381D178B]
U1  LM4040AIZ-4.1/NOPBLP3  [LP3]
U2  TL084CNN14  [N14]
U3  TL084CNN14  [N14]
U4  LM4040AIZ-4.1/NOPBLP3  [LP3]
U5  LM4040AIZ-4.1/NOPBLP3  [LP3]
U6  TL084CNN14  [N14]
U7  LM4040AIZ-4.1/NOPBLP3  [LP3]
U8  LM4040AIZ-4.1/NOPBLP3  [LP3]
U9  TL084CNN14  [N14]
U10  LM4040AIZ-4.1/NOPBLP3  [LP3]
U11  Rotary Encoder  ACZ11BR1E-20FD1-20C  [CUI_ACZ11BR1E-20FD1-20C]
U12  TL084CNN14  [N14]
U13  TL084CNN14  [N14]
U14  TL084CNN14  [N14]
U15  LM4040AIZ-4.1/NOPBLP3  [LP3]
U16  TL084CNN14  [N14]
U18  TL084CNN14  [N14]
U19  LM4040AIZ-4.1/NOPBLP3  [LP3]
U20  LM4040AIZ-4.1/NOPBLP3  [LP3]

## Nets
+5V2: C21.P C31.P C32.P C33.P C34.P C35.P C36.P C37.P C38.P C42.P C46.P C47.P C48.P C49.P D5.A J7.1 J8.1 J9.1 J13.1 PICO-1.VBUS PICO-2.VBUS PICO-3.VBUS PICOCENTRAL.VBUS PS1.1(+VIN) R14.2 R26.2 R29.2 R40.2 R50.2 R60.2 R70.2 R80.2 R90.2 U2.4(VCC+) U3.4(VCC+) U6.4(VCC+) U9.4(VCC+) U12.4(VCC+) U13.4(VCC+) U14.4(VCC+) U16.4(VCC+) U18.4(VCC+)
-5V: C3.P C39.P C40.P C41.P C43.P C44.P C45.P C50.P C51.P C52.P PS1.3(+VOUT) R9.1 R31.1 R37.1 R47.1 R57.1 R77.1 R87.1 U2.11(VCC-) U3.11(VCC-) U6.11(VCC-) U9.11(VCC-) U12.11(VCC-) U13.11(VCC-) U14.11(VCC-) U16.11(VCC-) U18.11(VCC-)
GND: C2.N C4.N C6.N C9.N C10.N C12.N C14.N C16.N C18.N C20.N C22.N C23.N C25.N C26.N C27.N C28.N C29.N C30.N C31.N C32.N C33.N C34.N C35.N C36.N C37.N C38.N C39.N C40.N C41.N C42.N C43.N C44.N C45.N C46.N C47.N C48.N C49.N C50.N C51.N C52.N D2.1(A) D3.1(A) D4.1(A) D6.1(A) D7.1(A) D8.1(A) D9.1(A) D10.1(A) J1.1 J3.1 J5.1 J7.3 J8.3 J9.3 J13.3 J13.18 J14.3 P1.2 P2.2 P3.2 PICO-1.GND@8(GND) PICO-2.GND@8(GND) PICO-3.GND@8(GND) PICOCENTRAL.GND@1(GND) PICOCENTRAL.GND@6(GND) PICOCENTRAL.GND@8(GND) R5.2 R20.2 R32.2 R35.2 R45.2 R55.2 R65.2 R75.2 R85.2 U1.1(ANODE) U2.5(2IN+) U3.5(2IN+) U4.1(ANODE) U5.1(ANODE) U6.5(2IN+) U7.1(ANODE) U8.1(ANODE) U9.5(2IN+) U10.1(ANODE) U11.B U11.S1 U12.5(2IN+) U13.5(2IN+) U14.5(2IN+) U15.1(ANODE) U16.5(2IN+) U18.5(2IN+) U19.1(ANODE) U20.1(ANODE)
N$1: C5.P U14.8(3OUT)
N$2: R1.2 U13.2(1IN-)
N$3: C8.N C25.P R16.2 R30.1 R39.1 R40.1 U2.9(3IN-) U8.2(CATHODE)
N$4: R4.2 R4.3 R5.1
N$5: R2.2 U14.2(1IN-)
N$6: R2.1 R4.1 R6.1 U14.1(1OUT)
N$7: R6.2 R9.2 R10.1 U14.6(2IN-)
N$8: C1.P U13.8(3OUT)
N$9: C5.N C22.P R11.2 R12.1 R13.1 R14.1 U1.2(CATHODE) U14.9(3IN-)
N$10: D2.2(K) J7.7 PICO-1.GP28_A2 R25.2
N$11: R22.1
N$12: J8.4 PICO-2.3V3_EN
N$13: C4.P R12.2 U14.10(3IN+)
N$14: C11.N C26.P R42.2 R43.1 R49.1 R50.1 U5.2(CATHODE) U6.9(3IN-)
N$16: C3.N
N$17: D5.C
N$18: C21.N
N$19: J6.1 P3.1 U9.3(1IN+) U12.3(1IN+) U16.3(1IN+)
N$20: R10.2 R11.1 U14.7(2OUT)
N$21: C6.P R27.2 U3.10(3IN+)
N$22: J4.1 P2.1 U2.3(1IN+) U6.3(1IN+) U18.3(1IN+)
N$23: D1.2(K) J7.9 PICO-1.GP27_A1 R13.2
N$24: R19.2 R19.3 R20.1
N$25: R17.2 U3.2(1IN-)
N$26: R17.1 R19.1 R21.1 U3.1(1OUT)
N$27: R21.2 R22.2 R23.1 U3.6(2IN-)
N$28: R23.2 R24.1 U3.7(2OUT)
N$29: R15.2 U2.2(1IN-)
N$30: C27.P R90.1 U7.2(CATHODE)
N$31: C7.P U3.8(3OUT)
N$32: J9.4 PICO-3.3V3_EN
N$33: C9.P R30.2 U2.10(3IN+)
N$34: C7.N C23.P R24.2 R27.1 R28.1 R29.1 U3.9(3IN-) U4.2(CATHODE)
N$35: D4.2(K) J7.10 PICO-1.GP26_A0 R28.2
N$36: R15.1 R34.1 R36.1 U2.1(1OUT)
N$37: R34.2 R34.3 R35.1
N$38: R36.2 R37.2 R38.1 U2.6(2IN-)
N$39: R16.1 R38.2 U2.7(2OUT)
N$40: C13.N C28.P R52.2 R53.1 R59.1 R60.1 U9.9(3IN-) U10.2(CATHODE)
N$41: C10.P R43.2 U6.10(3IN+)
N$42: C8.P U2.8(3OUT)
N$43: C15.N C29.P R62.2 R63.1 R69.1 R70.1 U12.9(3IN-) U19.2(CATHODE)
N$44: J7.5 PICO-1.3V3
N$45: C11.P U6.8(3OUT)
N$46: C19.P U18.8(3OUT)
N$47: C13.P U9.8(3OUT)
N$48: R41.2 U6.2(1IN-)
N$49: C1.N C20.P R7.2 R8.1 R25.1 R26.1 U13.9(3IN-) U20.2(CATHODE)
N$50: J7.4 PICO-1.3V3_EN
N$51: R41.1 R44.1 R46.1 U6.1(1OUT)
N$52: R44.2 R44.3 R45.1
N$53: D3.2(K) J8.7 PICO-2.GP28_A2 R39.2
N$54: R46.2 R47.2 R48.1 U6.6(2IN-)
N$55: J10.1 J14.2 PICO-1.GP0 PICOCENTRAL.GP1
N$56: R42.1 R48.2 U6.7(2OUT)
N$57: J10.2 J14.1 PICO-1.GP1 PICOCENTRAL.GP0
N$58: J14.19 PICOCENTRAL.GP14
N$59: J11.1 J14.17 PICO-2.GP0 PICOCENTRAL.GP13
N$60: J11.2 J14.16 PICO-2.GP1 PICOCENTRAL.GP12
N$61: J12.1 J13.19 PICO-3.GP0 PICOCENTRAL.GP17
N$62: J12.2 J13.20 PICO-3.GP1 PICOCENTRAL.GP16
N$63: J14.20 PICOCENTRAL.GP15
N$64: J13.16 PICOCENTRAL.GP19 U11.A
N$65: J13.17 PICOCENTRAL.GP18 U11.C
N$67: DS1.2(VDD) J13.4 PICOCENTRAL.3V3_EN
N$68: DS1.1(GND) J13.13 PICOCENTRAL.GND@7(GND)
N$69: DS1.4(SDA) J13.15 PICOCENTRAL.GP20
N$70: DS1.3(SCL) J13.14 PICOCENTRAL.GP21
N$71: J10.4 PICO-1.GP2
N$72: C17.N C30.P R72.2 R73.1 R79.1 R80.1 U15.2(CATHODE) U16.9(3IN-)
N$73: J2.1 P1.1 U3.3(1IN+) U13.3(1IN+) U14.3(1IN+)
N$74: R1.1 R3.1 R18.1 U13.1(1OUT)
N$75: R18.2 R18.3 R32.1
N$76: R3.2 R31.2 R33.1 U13.6(2IN-)
N$77: R7.1 R33.2 U13.7(2OUT)
N$78: C12.P R83.2 U18.10(3IN+)
N$79: C2.P R8.2 U13.10(3IN+)
N$80: J7.2 PICO-1.VSYS
N$81: D6.2(K) J8.9 PICO-2.GP27_A1 R49.2
N$82: C17.P U16.8(3OUT)
N$83: R71.2 U16.2(1IN-)
N$84: R51.2 U9.2(1IN-)
N$85: R51.1 R54.1 R56.1 U9.1(1OUT)
N$86: R54.2 R54.3 R55.1
N$87: R56.2 R57.2 R58.1 U9.6(2IN-)
N$88: R52.1 R58.2 U9.7(2OUT)
N$89: J7.6 PICO-1.ADC_VREF
N$90: C16.P R63.2 U12.10(3IN+)
N$91: C14.P R53.2 U9.10(3IN+)
N$92: J7.8 PICO-1.AGND
N$93: D7.2(K) J9.7 PICO-3.GP28_A2 R59.2
N$94: R71.1 R74.1 R76.1 U16.1(1OUT)
N$95: J7.11 PICO-1.RUN
N$96: R61.2 U12.2(1IN-)
N$97: R61.1 R64.1 R66.1 U12.1(1OUT)
N$98: R64.2 R64.3 R65.1
N$99: R66.2 R67.2 R68.1 U12.6(2IN-)
N$100: R62.1 R68.2 U12.7(2OUT)
N$101: C18.P R73.2 U16.10(3IN+)
N$102: C15.P U12.8(3OUT)
N$103: D1.1(A)
N$104: J7.12 PICO-1.GP22
N$105: D9.2(K) J9.9 PICO-3.GP27_A1 R69.2
N$106: R67.1
N$107: J7.13 PICO-1.GND@7(GND)
N$108: R74.2 R74.3 R75.1
N$109: R76.2 R77.2 R78.1 U16.6(2IN-)
N$110: R72.1 R78.2 U16.7(2OUT)
N$111: J7.14 PICO-1.GP21
N$112: J7.15 PICO-1.GP20
N$113: J7.16 PICO-1.GP19
N$114: J7.17 PICO-1.GP18
N$115: D8.2(K) J9.10 PICO-3.GP26_A0 R79.2
N$116: J7.18 PICO-1.GND@6(GND)
N$117: J7.19 PICO-1.GP17
N$118: R81.2 U18.2(1IN-)
N$119: R81.1 R84.1 R86.1 U18.1(1OUT)
N$120: R84.2 R84.3 R85.1
N$121: R86.2 R87.2 R88.1 U18.6(2IN-)
N$122: R82.1 R88.2 U18.7(2OUT)
N$123: C19.N R82.2 R83.1 R89.1 U18.9(3IN-)
N$124: J7.20 PICO-1.GP16
N$125: J8.5 PICO-2.3V3
N$126: J8.2 PICO-2.VSYS
N$127: D10.2(K) J8.10 PICO-2.GP26_A0 R89.2
N$128: J8.6 PICO-2.ADC_VREF
N$129: J8.8 PICO-2.AGND
N$130: J8.11 PICO-2.RUN
N$131: J8.12 PICO-2.GP22
N$132: J8.13 PICO-2.GND@7(GND)
N$133: J8.14 PICO-2.GP21
N$134: J8.15 PICO-2.GP20
N$135: J8.16 PICO-2.GP19
N$136: J8.17 PICO-2.GP18
N$137: J8.18 PICO-2.GND@6(GND)
N$138: J8.19 PICO-2.GP17
N$139: J8.20 PICO-2.GP16
N$140: J9.5 PICO-3.3V3
N$141: J9.2 PICO-3.VSYS
N$142: J9.6 PICO-3.ADC_VREF
N$143: J9.8 PICO-3.AGND
N$144: J9.11 PICO-3.RUN
N$145: J9.12 PICO-3.GP22
N$146: J9.13 PICO-3.GND@7(GND)
N$147: J9.14 PICO-3.GP21
N$148: J9.15 PICO-3.GP20
N$149: J9.16 PICO-3.GP19
N$150: J9.17 PICO-3.GP18
N$151: J9.18 PICO-3.GND@6(GND)
N$152: J9.19 PICO-3.GP17
N$153: J9.20 PICO-3.GP16
N$154: J10.20 PICO-1.GP15
N$155: J10.19 PICO-1.GP14
N$156: J10.18 PICO-1.GND@4(GND)
N$157: J10.17 PICO-1.GP13
N$158: J10.16 PICO-1.GP12
N$159: J10.15 PICO-1.GP11
N$160: J10.14 PICO-1.GP10
N$161: J10.13 PICO-1.GND@3(GND)
N$162: J10.12 PICO-1.GP9
N$163: J10.11 PICO-1.GP8
N$164: J10.10 PICO-1.GP7
N$165: J10.9 PICO-1.GP6
N$166: J10.8 PICO-1.GND@2(GND)
N$167: J10.7 PICO-1.GP5
N$168: J10.6 PICO-1.GP4
N$169: J10.5 PICO-1.GP3
N$170: J14.18 PICOCENTRAL.GND@4(GND)
N$171: J10.3 PICO-1.GND@1(GND)
N$172: J11.20 PICO-2.GP15
N$173: J11.19 PICO-2.GP14
N$174: J11.18 PICO-2.GND@4(GND)
N$175: J11.17 PICO-2.GP13
N$176: J11.16 PICO-2.GP12
N$177: J11.15 PICO-2.GP11
N$178: J11.14 PICO-2.GP10
N$179: J11.13 PICO-2.GND@3(GND)
N$180: J11.12 PICO-2.GP9
N$181: J11.11 PICO-2.GP8
N$182: J11.10 PICO-2.GP7
N$183: J11.9 PICO-2.GP6
N$184: J11.8 PICO-2.GND@2(GND)
N$185: J11.7 PICO-2.GP5
N$186: J11.6 PICO-2.GP4
N$187: J11.5 PICO-2.GP3
N$188: J11.4 PICO-2.GP2
N$189: J11.3 PICO-2.GND@1(GND)
N$190: J12.20 PICO-3.GP15
N$191: J12.19 PICO-3.GP14
N$192: J12.18 PICO-3.GND@4(GND)
N$193: J12.17 PICO-3.GP13
N$194: J12.16 PICO-3.GP12
N$195: J12.15 PICO-3.GP11
N$196: J12.14 PICO-3.GP10
N$197: J12.13 PICO-3.GND@3(GND)
N$198: J12.12 PICO-3.GP9
N$199: J12.11 PICO-3.GP8
N$200: J12.10 PICO-3.GP7
N$201: J12.9 PICO-3.GP6
N$202: J12.8 PICO-3.GND@2(GND)
N$203: J12.7 PICO-3.GP5
N$204: J12.6 PICO-3.GP4
N$205: J12.5 PICO-3.GP3
N$206: J12.4 PICO-3.GP2
N$207: J12.3 PICO-3.GND@1(GND)
N$208: J13.2 PICOCENTRAL.VSYS
N$209: J13.5 PICOCENTRAL.3V3
N$210: J13.6 PICOCENTRAL.ADC_VREF
N$211: J13.7 PICOCENTRAL.GP28_A2
N$212: J13.8 PICOCENTRAL.AGND
N$213: J13.9 PICOCENTRAL.GP27_A1
N$214: J13.10 PICOCENTRAL.GP26_A0
N$215: J13.11 PICOCENTRAL.RUN
N$216: J13.12 PICOCENTRAL.GP22 U11.S2
N$218: J14.15 PICOCENTRAL.GP11
N$219: J14.14 PICOCENTRAL.GP10
N$220: J14.13 PICOCENTRAL.GND@3(GND)
N$221: J14.12 PICOCENTRAL.GP9
N$222: J14.11 PICOCENTRAL.GP8
N$223: J14.10 PICOCENTRAL.GP7
N$224: J14.9 PICOCENTRAL.GP6
N$225: J14.8 PICOCENTRAL.GND@2(GND)
N$226: J14.7 PICOCENTRAL.GP5
N$227: J14.6 PICOCENTRAL.GP4
N$228: J14.5 PICOCENTRAL.GP3
N$229: J14.4 PICOCENTRAL.GP2
Unconnected: DS1.5(RST) DS1.6(DC) DS1.7(CS) PICO-1.GND@5(GND) PICO-1.SWCLK PICO-1.SWDIO PICO-2.GND@5(GND) PICO-2.SWCLK PICO-2.SWDIO PICO-3.GND@5(GND) PICO-3.SWCLK PICO-3.SWDIO PICOCENTRAL.GND@5(GND) PICOCENTRAL.SWCLK PICOCENTRAL.SWDIO U1.3(NC) U2.12(4IN+) U2.13(4IN-) U2.14(4OUT) U3.12(4IN+) U3.13(4IN-) U3.14(4OUT) U4.3(NC) U5.3(NC) U6.12(4IN+) U6.13(4IN-) U6.14(4OUT) U7.3(NC) U8.3(NC) U9.12(4IN+) U9.13(4IN-) U9.14(4OUT) U10.3(NC) U12.12(4IN+) U12.13(4IN-) U12.14(4OUT) U13.12(4IN+) U13.13(4IN-) U13.14(4OUT) U14.12(4IN+) U14.13(4IN-) U14.14(4OUT) U15.3(NC) U16.12(4IN+) U16.13(4IN-) U16.14(4OUT) U18.12(4IN+) U18.13(4IN-) U18.14(4OUT) U19.3(NC) U20.3(NC)

## Buses
N$18
-5V,+5V2
-5V

## Notes on the sheet
- CT Input 1
- -5V
- +5V
- Non- Inverting Gain1 | Non- Inverting Gain2 | Non- Inverting Gain3
- +5V
- -5V
- +5V
- 30m\V | 30m\V | 30m\V
- Bypass Cap
- 3.3Vpp + Vdc offset | 3.3Vpp + Vdc offset
- 3.3Vpp + Vdc offset
- +5V to -5V
  Voltage Converter
- 3.3Vp-p
- Summation Amp3
- 3.3Vp-p | Summation Amp2
- -5V | -5V
- Precision Voltage      
  Reference (3.3V)
- LPF2
  2nd Order
- LPF3
  2nd Order
- LPF1
  2nd Order
- fo = 1020Hz | fo = 1020Hz
- -5V | Summation Amp1 | fo = 1020Hz
- Precision Voltage      
  Reference (3.3V)
- Precision Voltage      
  Reference (3.3V)
- +5V
- +5V
- +5V
- +5V
- Overvoltage 
  Protection
- Overvoltage
  Protection
- Overvoltage 
  Protection
- CT Input 2 | 30m\V
- 30m\V
- 30m\V
- 3.3Vpp + Vdc offset | 3.3Vpp + Vdc offset
- 3.3Vp-p | 3.3Vp-p
- -5V
- LPF1
  2nd Order
- -5V
- LPF1
  2nd Order
- fo = 1020Hz | fo = 1020Hz
- Summation Amp1 | 3.3Vp-p | 3.3Vpp + Vdc offset
- Summation Amp1
- Precision Voltage      
  Reference (3.3V)
- -5V
- Precision Voltage      
  Reference (3.3V)
- Summation Amp1
- LPF1
  2nd Order
- fo = 1020Hz
- +5V | +5V
- +5V
- Overvoltage 
  Protection
- Precision Voltage      
  Reference (3.3V)
- Overvoltage 
  Protection
- Overvoltage 
  Protection
- CT Input 3
- 30m\V
- 3.3Vpp + Vdc offset
- 3.3Vp-p
- 30m\V
- 30m\V
- -5V
- LPF1
  2nd Order
- fo = 1020Hz
- Summation Amp1
- 3.3Vp-p | 3.3Vp-p | 3.3Vpp + Vdc offset
- 3.3Vpp + Vdc offset
- -5V | -5V
- +5V
- Summation Amp1 | Summation Amp1
- LPF1
  2nd Order
- LPF1
  2nd Order
- fo = 1020Hz
- fo = 1020Hz
- Precision Voltage      
  Reference (3.3V)
- Overvoltage 
  Protection
- +5V
- +5V
- Precision Voltage      
  Reference (3.3V)
- Precision Voltage      
  Reference (3.3V)
- Overvoltage 
  Protection
- Overvoltage 
  Protection

## Power pins joined to a net without a drawn wire
GND: PS1.2(GND)

## Library data of the parts
C1-C23 C25-C52 = UPM2A100MED:UPM2A100MED: CAP ALUM 10UF 20% 100V RADIAL; A_MAX: 12.5; B_MAX: 0.5; B_NOM: 0.5; DESCRIPTION: CAP ALUM 10UF 20% 100V RADIAL; D_NOM: 6.3; E_NOM: 2.5; MF: NICHICON
D1-D4 D6-D10 = Fairchild Semiconductor - 1N4728A:FAIRCHILD_SEMICONDUCTOR_1N4728A: FAIR-DZEN-A1K2-2; COMPONENT_LINK_1_DESCRIPTION: Manufacturer URL; COMPONENT_LINK_1_URL: http://www.fairchildsemi.com/; COMPONENT_LINK_3_DESCRIPTION: Package Specification; COMPONENT_LINK_3_URL: http://www.fairchildsemi.com/dwg/DO/DO41A.pdf; DATASHEET: http://www.fairchildsemi.com/ds/1N/1N4744A.pdf; DATASHEET_VERSION: Rev. H3; FOOTPRINT_VARIANT_NAME_0: Manufacturer Recommended; IMPORTED: yes; IMPORTED_FROM: vault; IMPORT_TS: 1521843604; IR_UA: 100; MF: Fairchild Semiconductor; MOUNTING_TECHNOLOGY: Through Hole; MPN: 1N4728A; OPERATING_AND_STORAGE_TEMPERATURE_RANGE: -65 to 200 degC; PACKAGE: DO-41-2; PACKAGE_DESCRIPTION: 2-Pin Axial leaded, Body 2.72 x 5.2 mm, Lead Spread 25.4 mm; PACKAGE_VERSION: Rev. 2; PD_W: 1; PREFIX: D; RELEASE_DATE: 1396598095; ROHS: Yes; TEST_CURRENT_IZ_MA: 76; TOLERANCE: 5%; VAULT_GUID: BB5BB100-3A3D-49B5-B4BA-51B09125605A; VAULT_REVISION: 7D3D7113-8068-4E65-AD6A-1728C093E95D; VZ_MAX_V: 3.465; VZ_MIN_V: 3.135; ZZ_MAX_OHM: 10
D5 = 1N914:1N914: Fast Switching Diode DO-35 glass case a.k.a. 1N4148
DS1 = AOM12864A0-1.54WW-ANO:AOM12864A0-1.54WW-ANO: Non-Touch Graphic LCD Display Module - White OLED SPI 1.54in (39.12mm) 128 x 64; MANUFACTURER: Orient Display; MAXIMUM_PACKAGE_HEIGHT: 5.5mm; PARTREV: O; STANDARD: Manufacturer Recommendations
J1-J6 = 103321-1:103321-1: 01 MODII HDR SRST B/A .100CL; COMMENT: 103321-1
J7-J14 = 5-644456-0:5-644456-0; COMMENT: 5-644456-0; EU_ROHS_COMPLIANCE: Compliant
P1-P3 = 282837-2:282837-2: TERM BLOCK 5.08MM 2POS SIDE ENTY; COMMENT: 282837-2
PICO-1-PICO-3 PICOCENTRAL = RaspberryPi_Pico:RPI_PICO_IG
PS1 = R-78E5.0-1.0:R-78E5.0-1.0: 1.0 Amp SIP3 Single Output; MANUFACTURER: RECOM; MAXIMUM_PACKAGE_HEIGHT: 10.40mm; PARTREV: 6; STANDARD: Manufacturer Recommendations
R1 R2 R5 R13 R15 R17 R20 R25 R28 R32 R35 R39 R41 R45 R49 R51 R55 R59 R61 R65 R69 R71 R75 R79 R81 R85 R89 = Resistor:R-US: Resistor Fixed - ANSI; CATEGORY: Resistor; SUB-CATEGORY: Fixed
R3 R6-R12 R14 R16 R21-R24 R26 R27 R29-R31 R33 R36-R38 R40 R42 R43 R46-R48 R50 R52 R53 R56-R58 R60 R62 R63 R66-R68 R70 R72 R73 R76-R78 R80 R82 R83 R86-R88 R90 = Tutorial - Fusion 360:R-US: Resistor Fixed - ANSI; CATEGORY: Resistor; SUB-CATEGORY: Fixed
R4 R18 R19 R34 R44 R54 R64 R74 R84 = Potentiometer_Trimmers:3362P-1-103LF: TRIMMER 10K OHM 0.5W PC PIN TOP Manufacturer's datasheet <https://www.bourns.com/docs/Product-Datasheets/3362.pdf>; CREATED_PN: PCBLayout.com; DIGIKEY_PN: 3362P-103LF-ND; MANUFACTURER: Bourns Inc.; MPN: 3362P-1-103LF
U1 U4 U5 U7 U8 U10 U15 U19 U20 = Library:LM4040AIZ-4.1/NOPB; COPYRIGHT: Copyright (C) 2023 Ultra Librarian. All rights reserved.; MANUFACTURER_PART_NUMBER: LM4040AIZ-4.1/NOPB; MFR_NAME: Texas Instruments
U2 U3 U6 U9 U12-U14 U16 U18 = 2023-02-17_00-49-57_Library:TL084CN; COPYRIGHT: Copyright (C) 2023 Ultra Librarian. All rights reserved.; MANUFACTURER_PART_NUMBER: TL084CN; MFR_NAME: Texas Instruments
U11 = ACZ11BR1E-20FD1-20C:ACZ11BR1E-20FD1-20C: 11 mm, 12 ~ 20 PPR, Through Hole, Mechanical Panel Mount Encoder; MANUFACTURER: CUI Devices; MAXIMUM_PACKAGE_HEIGHT: 26.5mm; PARTREV: 1.02; STANDARD: Manufacturer Recommendations